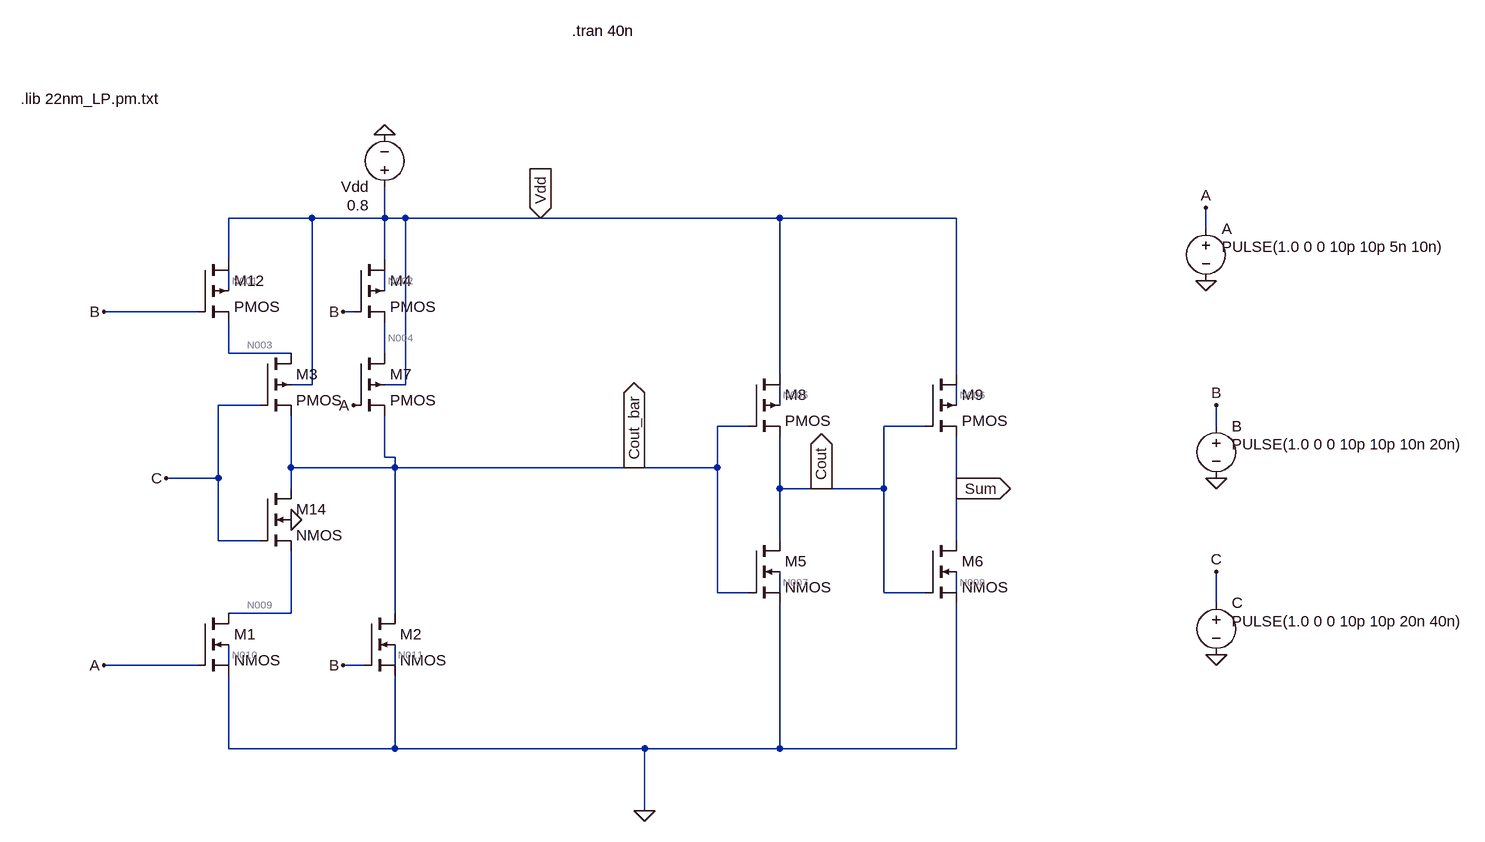
[diagram p0: schematic AMA3_22nm.asc]
AMA3_22nm.asc, the LTspice schematic file:
Version 4
SHEET 1 1044 692
WIRE -752 -240 -880 -240
WIRE -640 -240 -640 -288
WIRE -640 -240 -752 -240
WIRE -608 -240 -640 -240
WIRE -400 -240 -608 -240
WIRE -32 -240 -400 -240
WIRE 240 -240 -32 -240
WIRE 624 -224 624 -256
WIRE -880 -176 -880 -240
WIRE -640 -176 -640 -240
WIRE -880 -128 -880 -160
WIRE -640 -128 -640 -160
WIRE -928 -96 -1072 -96
WIRE -688 -96 -704 -96
WIRE -880 -32 -880 -80
WIRE -784 -32 -880 -32
WIRE -640 -32 -640 -80
WIRE -32 0 -32 -240
WIRE 240 0 240 -240
WIRE -752 16 -752 -240
WIRE -752 16 -784 16
WIRE -608 16 -608 -240
WIRE -608 16 -640 16
WIRE -832 48 -896 48
WIRE -32 48 -32 16
WIRE 240 48 240 16
WIRE -80 80 -128 80
WIRE 192 80 128 80
WIRE 640 80 640 48
WIRE -640 128 -640 64
WIRE -624 128 -640 128
WIRE -784 144 -784 64
WIRE -624 144 -624 128
WIRE -624 144 -784 144
WIRE -256 144 -624 144
WIRE -128 144 -128 80
WIRE -128 144 -256 144
WIRE -896 160 -896 48
WIRE -896 160 -976 160
WIRE -784 176 -784 144
WIRE -32 176 -32 96
WIRE 32 176 -32 176
WIRE 128 176 128 80
WIRE 128 176 32 176
WIRE 240 176 240 96
WIRE -896 256 -896 160
WIRE -832 256 -896 256
WIRE -32 256 -32 176
WIRE 240 256 240 176
WIRE -128 336 -128 144
WIRE -80 336 -128 336
WIRE -32 336 -32 304
WIRE 128 336 128 176
WIRE 192 336 128 336
WIRE 240 336 240 304
WIRE 640 352 640 304
WIRE -784 368 -784 272
WIRE -784 368 -880 368
WIRE -624 368 -624 144
WIRE -928 448 -1072 448
WIRE -880 448 -880 416
WIRE -672 448 -704 448
WIRE -624 448 -624 416
WIRE -880 576 -880 464
WIRE -624 576 -624 464
WIRE -624 576 -880 576
WIRE -240 576 -624 576
WIRE -32 576 -32 352
WIRE -32 576 -240 576
WIRE 240 576 240 352
WIRE 240 576 -32 576
WIRE -240 672 -240 576
FLAG -240 672 0
FLAG -256 144 Cout_bar
IOPIN -256 144 Out
FLAG 240 176 Sum
IOPIN 240 176 Out
FLAG 624 -144 0
FLAG 640 160 0
FLAG 640 432 0
FLAG 624 -256 A
FLAG 640 48 B
FLAG 640 304 C
FLAG -976 160 C
FLAG -400 -240 Vdd
IOPIN -400 -240 In
FLAG -640 -368 0
FLAG -784 224 0
FLAG 32 176 Cout
IOPIN 32 176 Out
FLAG -688 48 A
FLAG -1072 448 A
FLAG -1072 -96 B
FLAG -704 -96 B
FLAG -704 448 B
SYMBOL pmos4 -928 -176 R0
SYMATTR InstName M12
SYMATTR Value2 l=22n w=88n
SYMBOL nmos4 -832 176 R0
SYMATTR InstName M14
SYMATTR Value2 l=22n w=44n
SYMBOL voltage 624 -240 R0
WINDOW 3 24 44 Left 2
WINDOW 123 0 0 Left 0
WINDOW 39 0 0 Left 0
SYMATTR Value PULSE(1.0 0 0 10p 10p 5n 10n)
SYMATTR InstName A
SYMBOL voltage 640 64 R0
WINDOW 3 24 44 Left 2
WINDOW 123 0 0 Left 0
WINDOW 39 0 0 Left 0
SYMATTR Value PULSE(1.0 0 0 10p 10p 10n 20n)
SYMATTR InstName B
SYMBOL voltage 640 336 R0
WINDOW 3 24 44 Left 2
WINDOW 123 0 0 Left 0
WINDOW 39 0 0 Left 0
SYMATTR Value PULSE(1.0 0 0 10p 10p 20n 40n)
SYMATTR InstName C
SYMBOL voltage -640 -272 R180
WINDOW 3 24 -12 Left 2
WINDOW 123 0 0 Left 0
WINDOW 39 0 0 Left 0
SYMATTR Value 0.8
SYMATTR InstName Vdd
SYMBOL pmos4 -832 -32 R0
SYMATTR InstName M3
SYMATTR Value2 l=22n w=88n
SYMBOL pmos4 -688 -176 R0
SYMATTR InstName M4
SYMATTR Value2 l=22n w=88n
SYMBOL pmos4 -688 -32 R0
SYMATTR InstName M7
SYMATTR Value2 l=22n w=88n
SYMBOL pmos4 -80 0 R0
SYMATTR InstName M8
SYMATTR Value2 l=22n w=88n
SYMBOL pmos4 192 0 R0
SYMATTR InstName M9
SYMATTR Value2 l=22n w=88n
SYMBOL nmos4 -928 368 R0
SYMATTR InstName M1
SYMATTR Value2 l=22n w=44n
SYMBOL nmos4 -672 368 R0
SYMATTR InstName M2
SYMATTR Value2 l=22n w=44n
SYMBOL nmos4 -80 256 R0
SYMATTR InstName M5
SYMATTR Value2 l=22n w=44n
SYMBOL nmos4 192 256 R0
SYMATTR InstName M6
SYMATTR Value2 l=22n w=44n
TEXT -1200 -424 Left 2 !.lib 22nm_LP.pm.txt
TEXT -352 -528 Left 2 !.tran 40n

The netlist it stands for:
* AMA3_22nm.asc
M12 Vdd B N003 N001 PMOS l=22n w=88n
M14 Cout_bar C N009 0 NMOS l=22n w=44n
V§A A 0 PULSE(1.0 0 0 10p 10p 5n 10n)
V§B B 0 PULSE(1.0 0 0 10p 10p 10n 20n)
V§C C 0 PULSE(1.0 0 0 10p 10p 20n 40n)
Vdd Vdd 0 0.8
M3 N003 C Cout_bar Vdd PMOS l=22n w=88n
M4 Vdd B N004 N002 PMOS l=22n w=88n
M7 N004 A Cout_bar Vdd PMOS l=22n w=88n
M8 Vdd Cout_bar Cout N005 PMOS l=22n w=88n
M9 Vdd Cout Sum N006 PMOS l=22n w=88n
M1 N009 A 0 N010 NMOS l=22n w=44n
M2 Cout_bar B 0 N011 NMOS l=22n w=44n
M5 Cout Cout_bar 0 N007 NMOS l=22n w=44n
M6 Sum Cout 0 N008 NMOS l=22n w=44n
.model NMOS NMOS
.model PMOS PMOS
.lib standard.mos
.lib 22nm_LP.pm.txt
.tran 40n
.backanno
.end

* Results of the author's LTspice run, read from the files saved beside the schematic
* Operating Point, zero values left out:
*   V(vdd) = 800 mV
*   V(b) = 1 V
*   V(n003) = 694.5 mV
*   V(n001) = 694.2 mV
*   V(cout_bar) = 269.5 nV
*   V(c) = 1 V
*   V(n009) = 249.4 nV
*   V(a) = 1 V
*   V(n004) = 694.5 mV
*   V(n002) = 694.2 mV
*   V(cout) = 799.9 mV
*   V(n005) = 677.6 mV
*   V(sum) = 111.2 µV
*   V(n006) = 675.4 mV
*   V(n010) = 175.7 mV
*   V(n011) = 175.7 mV
*   V(n007) = 247.2 mV
*   V(n008) = 62.99 mV
*   Id(M6) = 20.33 nA
*   Ig(M6) = 14.22 pA
*   Is(M6) = -20.35 nA
*   Id(M5) = 19.67 nA
*   Ig(M5) = -9.184 pA
*   Is(M5) = -19.66 nA
*   Id(M2) = 27.96 pA
*   Ig(M2) = 48.6 pA
*   Is(M2) = -76.38 pA
*   Id(M1) = 23.72 pA
*   Ig(M1) = 48.6 pA
*   Is(M1) = -72.14 pA
*   Id(M14) = -15.51 pA
*   Ig(M14) = 51.03 pA
*   Ib(M14) = -11.81 pA
*   Is(M14) = -23.72 pA
*   Id(M9) = 20.33 nA
*   Is(M9) = -20.33 nA
*   Id(M8) = 19.69 nA
*   Is(M8) = -19.69 nA
*   Is(M7) = -1.29 pA
*   Id(M4) = 1.065 pA
*   Is(M3) = -1.29 pA
*   Id(M12) = 1.065 pA
*   I(Vdd) = -40.03 nA
*   I(C) = -51.04 pA
*   I(B) = -48.6 pA
*   I(A) = -48.6 pA
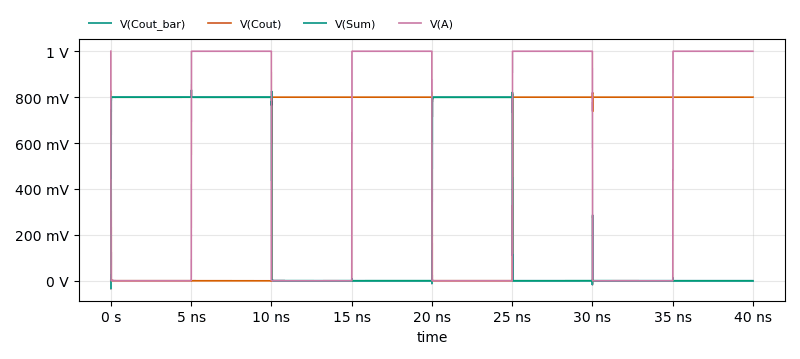
[diagram p1: Transient Analysis of AMA3_22nm.asc, plotted from the saved traces]
* Transient Analysis, 1 run:
*   V(Cout_bar): min -35.12 mV, max 831.3 mV, average 300.1 mV, rms 489.6 mV, last 1.11 µV
*   V(Cout): min -824.1 µV, max 824 mV, average 499.7 mV, rms 632 mV, last 799.9 mV
*   V(Sum): min -3.831 mV, max 825 mV, average 300.4 mV, rms 490 mV, last 112.2 µV
*   V(A): min 0 V, max 1 V, average 499 mV, rms 706.2 mV, last 1 V